# EAGLE design detectino (EAGLE 7.2.0)
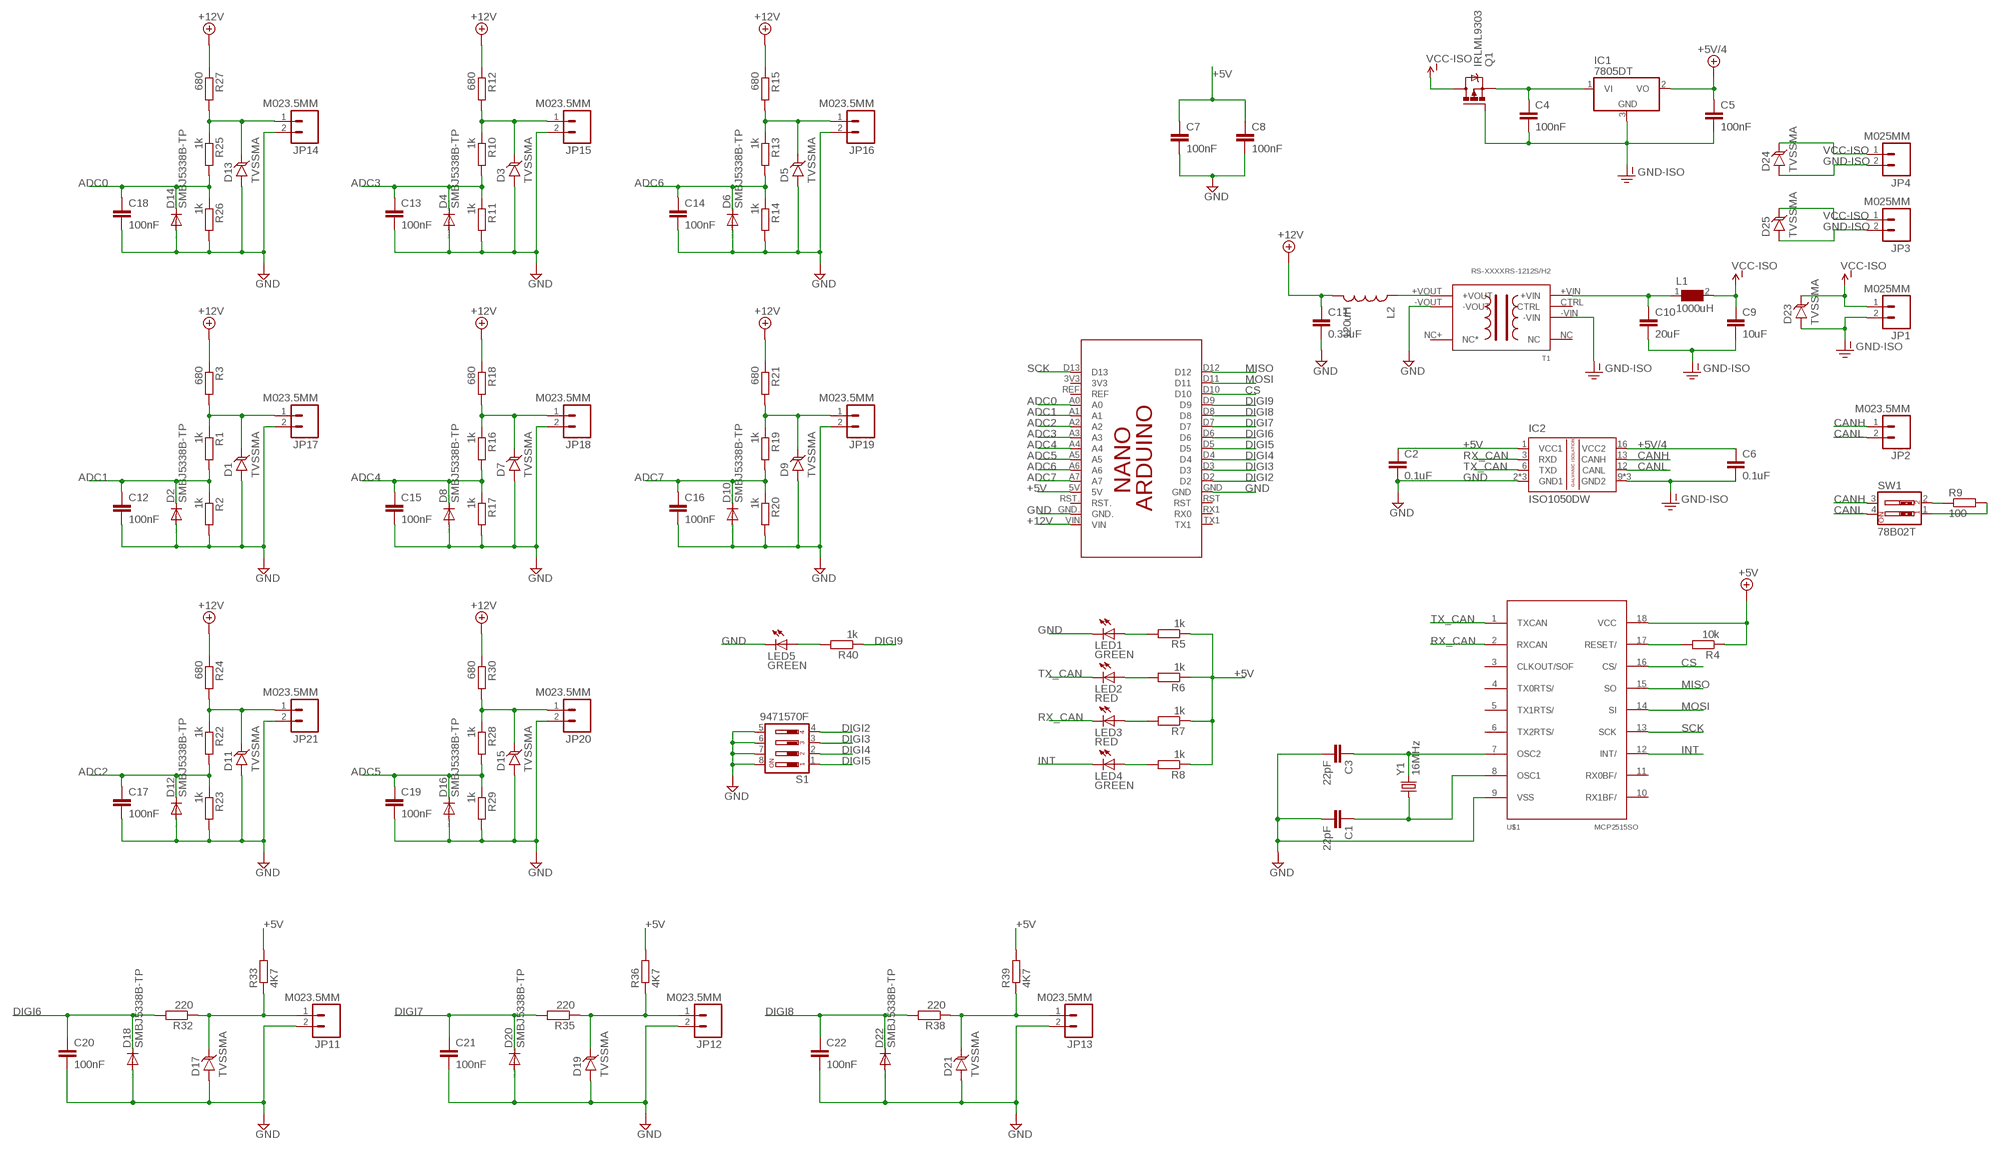
[diagram p0: schematic, sheet 1]

## Parts
C1  22pF  C-EUC0805K  [C0805K]
C2  0.1uF  C-EUC0805K  [C0805K]
C3  22pF  C-EUC0805K  [C0805K]
C4  100nF  C-EUC0805K  [C0805K]
C5  100nF  C-EUC0805K  [C0805K]
C6  0.1uF  C-EUC0805K  [C0805K]
C7  100nF  C-EUC0805K  [C0805K]
C8  100nF  C-EUC0805K  [C0805K]
C9  10uF  C-EUC0805K  [C0805K]
C10  20uF  C-EUC0805K  [C0805K]
C11  0.33uF  C-EUC0805K  [C0805K]
C12  100nF  C-EUC0805K  [C0805K]
C13  100nF  C-EUC0805K  [C0805K]
C14  100nF  C-EUC0805K  [C0805K]
C15  100nF  C-EUC0805K  [C0805K]
C16  100nF  C-EUC0805K  [C0805K]
C17  100nF  C-EUC0805K  [C0805K]
C18  100nF  C-EUC0805K  [C0805K]
C19  100nF  C-EUC0805K  [C0805K]
C20  100nF  C-EUC0805K  [C0805K]
C21  100nF  C-EUC0805K  [C0805K]
C22  100nF  C-EUC0805K  [C0805K]
D1  TVSSMA  [SMA-DIODE]
D2  SMBJ5338B-TP  DIODE-DO214AA  [DO214AA]
D3  TVSSMA  [SMA-DIODE]
D4  SMBJ5338B-TP  DIODE-DO214AA  [DO214AA]
D5  TVSSMA  [SMA-DIODE]
D6  SMBJ5338B-TP  DIODE-DO214AA  [DO214AA]
D7  TVSSMA  [SMA-DIODE]
D8  SMBJ5338B-TP  DIODE-DO214AA  [DO214AA]
D9  TVSSMA  [SMA-DIODE]
D10  SMBJ5338B-TP  DIODE-DO214AA  [DO214AA]
D11  TVSSMA  [SMA-DIODE]
D12  SMBJ5338B-TP  DIODE-DO214AA  [DO214AA]
D13  TVSSMA  [SMA-DIODE]
D14  SMBJ5338B-TP  DIODE-DO214AA  [DO214AA]
D15  TVSSMA  [SMA-DIODE]
D16  SMBJ5338B-TP  DIODE-DO214AA  [DO214AA]
D17  TVSSMA  [SMA-DIODE]
D18  SMBJ5338B-TP  DIODE-DO214AA  [DO214AA]
D19  TVSSMA  [SMA-DIODE]
D20  SMBJ5338B-TP  DIODE-DO214AA  [DO214AA]
D21  TVSSMA  [SMA-DIODE]
D22  SMBJ5338B-TP  DIODE-DO214AA  [DO214AA]
D23  TVSSMA  [SMA-DIODE]
D24  TVSSMA  [SMA-DIODE]
D25  TVSSMA  [SMA-DIODE]
IC1  7805DT  [TO252]
IC2  ISO1050DW  [SO-16DW]
JP1  M025MM  [SCREWTERMINAL-5MM-2]
JP2  M023.5MM  [SCREWTERMINAL-3.5MM-2]
JP3  M025MM  [SCREWTERMINAL-5MM-2]
JP4  M025MM  [SCREWTERMINAL-5MM-2]
JP11  M023.5MM  [SCREWTERMINAL-3.5MM-2]
JP12  M023.5MM  [SCREWTERMINAL-3.5MM-2]
JP13  M023.5MM  [SCREWTERMINAL-3.5MM-2]
JP14  M023.5MM  [SCREWTERMINAL-3.5MM-2]
JP15  M023.5MM  [SCREWTERMINAL-3.5MM-2]
JP16  M023.5MM  [SCREWTERMINAL-3.5MM-2]
JP17  M023.5MM  [SCREWTERMINAL-3.5MM-2]
JP18  M023.5MM  [SCREWTERMINAL-3.5MM-2]
JP19  M023.5MM  [SCREWTERMINAL-3.5MM-2]
JP20  M023.5MM  [SCREWTERMINAL-3.5MM-2]
JP21  M023.5MM  [SCREWTERMINAL-3.5MM-2]
L1  1000uH  WE-TIS-7447471102_1111  [WE-TIS_1111]
L2  120uH  INDUCTORSDR0403-560KL  [SDR0403]
LED1  GREEN  LEDSML0805  [SML0805]
LED2  RED  LEDSML0805  [SML0805]
LED3  RED  LEDSML0805  [SML0805]
LED4  GREEN  LEDSML0805  [SML0805]
LED5  GREEN  LEDSML0805  [SML0805]
PCB2  ARDUINO_NANO  [ARDUINO_NANO]
Q1  IRLML9303  IRLML5203  [MICRO3]
R1  1k  R-EU_0204/5  [0204/5]
R2  1k  R-EU_0204/5  [0204/5]
R3  680  R-EU_0204/5  [0204/5]
R4  10k  R-EU_R0805W  [R0805W]
R5  1k  R-EU_0204/5  [0204/5]
R6  1k  R-EU_0204/5  [0204/5]
R7  1k  R-EU_0204/5  [0204/5]
R8  1k  R-EU_0204/5  [0204/5]
R9  100  R-EU_R0805W  [R0805W]
R10  1k  R-EU_0204/5  [0204/5]
R11  1k  R-EU_0204/5  [0204/5]
R12  680  R-EU_0204/5  [0204/5]
R13  1k  R-EU_0204/5  [0204/5]
R14  1k  R-EU_0204/5  [0204/5]
R15  680  R-EU_0204/5  [0204/5]
R16  1k  R-EU_0204/5  [0204/5]
R17  1k  R-EU_0204/5  [0204/5]
R18  680  R-EU_0204/5  [0204/5]
R19  1k  R-EU_0204/5  [0204/5]
R20  1k  R-EU_0204/5  [0204/5]
R21  680  R-EU_0204/5  [0204/5]
R22  1k  R-EU_0204/5  [0204/5]
R23  1k  R-EU_0204/5  [0204/5]
R24  680  R-EU_0204/5  [0204/5]
R25  1k  R-EU_0204/5  [0204/5]
R26  1k  R-EU_0204/5  [0204/5]
R27  680  R-EU_0204/5  [0204/5]
R28  1k  R-EU_0204/5  [0204/5]
R29  1k  R-EU_0204/5  [0204/5]
R30  680  R-EU_0204/5  [0204/5]
R32  220  R-EU_0204/5  [0204/5]
R33  4K7  R-EU_0204/5  [0204/5]
R35  220  R-EU_0204/5  [0204/5]
R36  4K7  R-EU_0204/5  [0204/5]
R38  220  R-EU_0204/5  [0204/5]
R39  4K7  R-EU_0204/5  [0204/5]
R40  1k  R-EU_0204/5  [0204/5]
S1  9471570F  DS04  [DS-04]
SW1  78B02T  SW_DIP-2  [DIPSWITCH-02]
T1  RS-XXXXRS-1212S/H2  [SIP8]
U$1  MCP2515SO  [SO18L]
Y1  16MHz  CRYSTALHC49US  [HC49US]

## Nets
+5V: C2.1 C7.1 C8.1 IC2.1(VCC1) PCB2.5V R4.1 R5.1 R6.1 R7.1 R8.1 R33.2 R36.2 R39.2 U$1.18(VCC)
+5V/4: C5.1 C6.1 IC1.2(VO) IC2.16(VCC2)
+12V [vcc]: C11.1 L2.P$2 PCB2.VIN R3.1 R12.1 R15.1 R18.1 R21.1 R24.1 R27.1 R30.1
ADC0: C18.1 D14.C PCB2.A0 R25.2 R26.1
ADC1: C12.1 D2.C PCB2.A1 R1.2 R2.1
ADC2: C17.1 D12.C PCB2.A2 R22.2 R23.1
ADC3: C13.1 D4.C PCB2.A3 R10.2 R11.1
ADC4: C15.1 D8.C PCB2.A4 R16.2 R17.1
ADC5: C19.1 D16.C PCB2.A5 R28.2 R29.1
ADC6: C14.1 D6.C PCB2.A6 R13.2 R14.1
ADC7: C16.1 D10.C PCB2.A7 R19.2 R20.1
CANH: IC2.13(CANH) JP2.1 SW1.3
CANL: IC2.12(CANL) JP2.2 SW1.4
CS: PCB2.D10 U$1.16(CS/)
DIGI2: PCB2.D2 S1.4
DIGI3: PCB2.D3 S1.3
DIGI4: PCB2.D4 S1.2
DIGI5: PCB2.D5 S1.1
DIGI6: C20.1 D18.C PCB2.D6 R32.2
DIGI7: C21.1 D20.C PCB2.D7 R35.2
DIGI8: C22.1 D22.C PCB2.D8 R38.2
DIGI9: PCB2.D9 R40.1
GND: C1.2 C2.2 C3.2 C7.2 C8.2 C11.2 C12.2 C13.2 C14.2 C15.2 C16.2 C17.2 C18.2 C19.2 C20.2 C21.2 C22.2 D1.A D2.A D3.A D4.A D5.A D6.A D7.A D8.A D9.A D10.A D11.A D12.A D13.A D14.A D15.A D16.A D17.A D18.A D19.A D20.A D21.A D22.A IC2.2(GND1) IC2.7(GND1) IC2.8(GND1) JP11.2 JP12.2 JP13.2 JP14.2 JP15.2 JP16.2 JP17.2 JP18.2 JP19.2 JP20.2 JP21.2 LED1.C LED5.C PCB2.GND PCB2.GND. R2.2 R11.2 R14.2 R17.2 R20.2 R23.2 R26.2 R29.2 S1.5 S1.6 S1.7 S1.8 T1.-VOUT U$1.9(VSS)
GND-ISO: C4.2 C5.2 C6.2 C9.2 C10.2 D23.A D24.A D25.A IC1.3(GND) IC2.9(GND2) IC2.10(GND2) IC2.15(GND2) JP1.2 JP3.2 JP4.2 Q1.1(G) T1.-VIN
INT: LED4.C U$1.12(INT/)
MISO: PCB2.D12 U$1.15(SO)
MOSI: PCB2.D11 U$1.14(SI)
N$1: D1.C JP17.1 R1.1 R3.2
N$2: R4.2 U$1.17(RESET/)
N$3: C1.1 U$1.8(OSC1) Y1.1
N$4: C3.1 U$1.7(OSC2) Y1.2
N$5: C4.1 IC1.1(VI) Q1.2(S)
N$6: LED1.A R5.2
N$7: LED2.A R6.2
N$8: LED3.A R7.2
N$9: LED4.A R8.2
N$10: C10.1 L1.1 T1.+VIN
N$11: R9.1 SW1.2
N$12: R9.2 SW1.1
N$13: D3.C JP15.1 R10.1 R12.2
N$14: D5.C JP16.1 R13.1 R15.2
N$15: D7.C JP18.1 R16.1 R18.2
N$16: D9.C JP19.1 R19.1 R21.2
N$17: D11.C JP21.1 R22.1 R24.2
N$18: D13.C JP14.1 R25.1 R27.2
N$19: D15.C JP20.1 R28.1 R30.2
N$20: L2.P$1 T1.+VOUT
N$21: D17.C JP11.1 R32.1 R33.1
N$23: D19.C JP12.1 R35.1 R36.1
N$25: D21.C JP13.1 R38.1 R39.1
N$26: LED5.A R40.2
RX_CAN: IC2.3(RXD) LED3.C U$1.2(RXCAN)
SCK: PCB2.D13 U$1.13(SCK)
TX_CAN: IC2.6(TXD) LED2.C U$1.1(TXCAN)
VCC-ISO [vcc]: C9.1 D23.C D24.C D25.C JP1.1 JP3.1 JP4.1 L1.2 Q1.3(D)
Unconnected: PCB2.3V3 PCB2.REF PCB2.RST PCB2.RST. PCB2.RX1(RX0) PCB2.TX1 T1.CTRL T1.NC T1.NC+(NC*) U$1.3(CLKOUT/SOF) U$1.4(TX0RTS/) U$1.5(TX1RTS/) U$1.6(TX2RTS/) U$1.10(RX1BF/) U$1.11(RX0BF/)

## Library data of the parts
C1-C22 = rcl:C-EU: CAPACITOR, European symbol
D1 D3 D5 D7 D9 D11 D13 D15 D17 D19 D21 D23-D25 = SparkFun-DiscreteSemi:TVS: Transient voltage suppressor- prevents ESD on inputs.
D2 D4 D6 D8 D10 D12 D14 D16 D18 D20 D22 = diode:DIODE-: DIODE
IC1 = linear:78*: Positive VOLTAGE REGULATOR Source: http://cache.national.com/ds/LM/LM78L05.pdf http://www.fairchildsemi.com/ds/LM/LM7805.pdf
IC2 = texas:ISO1050: ISOLATED CAN TRANSCEIVER Source: http://focus.ti.com/lit/ds/symlink/iso1050.pdf
JP1 JP3 JP4 = SparkFun-Connectors:M02: Standard 2-pin 0.1" header. Use with - straight break away headers ( PRT-00116) - right angle break away headers (PRT-00553) - swiss pins (PRT-00743) - machine pins (PRT-00117) - female headers (PRT-00115) Molex polarized connector foot print use with: PRT-08233 with associated crimp pins and housings. 2.54_SCREWTERM for use with PRT-10571. 3.5mm Screw Terminal footprints for PRT-08084 5mm Screw Terminal footprints for use with PRT-08432; STOREFRONT_ID: PRT-08432
JP2 JP11-JP21 = SparkFun-Connectors:M02: Standard 2-pin 0.1" header. Use with - straight break away headers ( PRT-00116) - right angle break away headers (PRT-00553) - swiss pins (PRT-00743) - machine pins (PRT-00117) - female headers (PRT-00115) Molex polarized connector foot print use with: PRT-08233 with associated crimp pins and housings. 2.54_SCREWTERM for use with PRT-10571. 3.5mm Screw Terminal footprints for PRT-08084 5mm Screw Terminal footprints for use with PRT-08432
L1 = WE-TIS:WE-TIS: Shielded Radial Leaded Inductor - Shielded radial through-hole inductor - High rated and saturation current - High inductance values - Low stray field -- Filter choke -- Storage choke -- Class D amplifiers; MPN: 7447471102; OC_FARNELL: 2211759; OC_NEWARK: 44W4694; PACKAGE: 1111; SUPPLIER: Wuerth Elektronik
L2 = SparkFun-Passives:INDUCTOR: Inductors Basic Inductor/Choke - 0603 and 1206. Footprints are not proven and vary greatly between part numbers. SRN6045- 33uH, 20% 1.4A SDR0403-560KL - 56uH, 10%, 500mA RMS/740mA peak; DIST: DIGIKEY; DIST_ID: SDR0403-560KLCT-ND; VALUE: 56uH
LED1-LED5 = led:LED: LED OSRAM: - CHIPLED LG R971, LG N971, LY N971, LG Q971, LY Q971, LO R971, LY R971 LH N974, LH R974 LS Q976, LO Q976, LY Q976 LO Q996 - Hyper CHIPLED LW Q18S LB Q993, LB Q99A, LB R99A - SideLED LS A670, LO A670, LY A670, LG A670, LP A670 LB A673, LV A673, LT A673, LW A673 LH A674 LY A675 LS A676, LA A676, LO A676, LY A676, LW A676 LS A679, LY A679, LG A679 - Hyper Micro SIDELED® LS Y876, LA Y876, LO Y876, LY Y876 LT Y87S - SmartLED LW L88C, LW L88S LB L89C, LB L89S, LG L890 LS L89K, LO L89K, LY L89K LS L896, LA L896, LO L896, LY L896 - TOPLED LS T670, LO T670, LY T670, LG T670, LP T670 LSG T670, LSP T670, LSY T670, LOP T670, LYG T670 LG T671, LOG T671, LSG T671 LB T673, LV T673, LT T673, LW T673 LH T674 LS T676, LA T676, LO T676, LY T676, LB T676, LH T676, LSB T676, LW T676 LB T67C, LV T67C, LT T67C, LS T67K, LO T67K, LY T67K, LW E67C LS E67B, LA E67B, LO E67B, LY E67B, LB E67C, LV E67C, LT E67C LW T67C LS T679, LY T679, LG T679 LS T770, LO T770, LY T770, LG T770, LP T770 LB T773, LV T773, LT T773, LW T773 LH T774 LS E675, LA E675, LY E675, LS T675 LS T776, LA T776, LO T776, LY T776, LB T776 LHGB T686 LT T68C, LB T68C - Hyper Mini TOPLED® LB M676 - Mini TOPLED Santana® LG M470 LS M47K, LO M47K, LY M47K Source: http://www.osram.convergy.de LUXEON: - LUMILED® LXK2-PW12-R00, LXK2-PW12-S00, LXK2-PW14-U00, LXK2-PW14-V00 LXK2-PM12-R00, LXK2-PM12-S00, LXK2-PM14-U00 LXK2-PE12-Q00, LXK2-PE12-R00, LXK2-PE12-S00, LXK2-PE14-T00, LXK2-PE14-U00 LXK2-PB12-K00, LXK2-PB12-L00, LXK2-PB12-M00, LXK2-PB14-N00, LXK2-PB14-P00, LXK2-PB14-Q00 LXK2-PR12-L00, LXK2-PR12-M00, LXK2-PR14-Q00, LXK2-PR14-R00 LXK2-PD12-Q00, LXK2-PD12-R00, LXK2-PD12-S00 LXK2-PH12-R00, LXK2-PH12-S00 LXK2-PL12-P00, LXK2-PL12-Q00, LXK2-PL12-R00 Source: www.luxeon.com KINGBRIGHT: KA-3528ASYC Source: www.kingbright.com
PCB2 = E14_Arduino_published:ARDUINO_NANO: Device for representing an Arduino Nano board with a footprint in an EAGLE design. Created by Dave Young for Element14. More EAGLE documentation at: http://www.element14.com/community/community/knode/cadsoft_eagle
Q1 = transistor-power:IRLML5203: HEXFET P-Channel Power MOSFET
R1-R30 R32 R33 R35 R36 R38-R40 = rcl:R-EU_: RESISTOR, European symbol
S1 = switch-dil:DS04: DIL/CODE SWITCH; OC_FARNELL: 9471570; OC_NEWARK: unknown
SW1 = SparkFun-Electromechanical:SW_DIP-2: DIP SWITCH
T1 = matteo:RS-XXXX
U$1 = MCP2515_MT:MCP2515*: MCP2515 Standalone CAN-Controller by Microchip Eagle-Lib. by MartinThomas
Y1 = SparkFun-FreqCtrl:CRYSTAL: Various standard crystals. Proven footprints.

## Net classes
0 default: width 0.508 mm, clearance 0.203 mm
1 ground: width 0.762 mm, clearance 0.203 mm
2 vcc: width 0.762 mm, clearance 0.203 mm

## Board
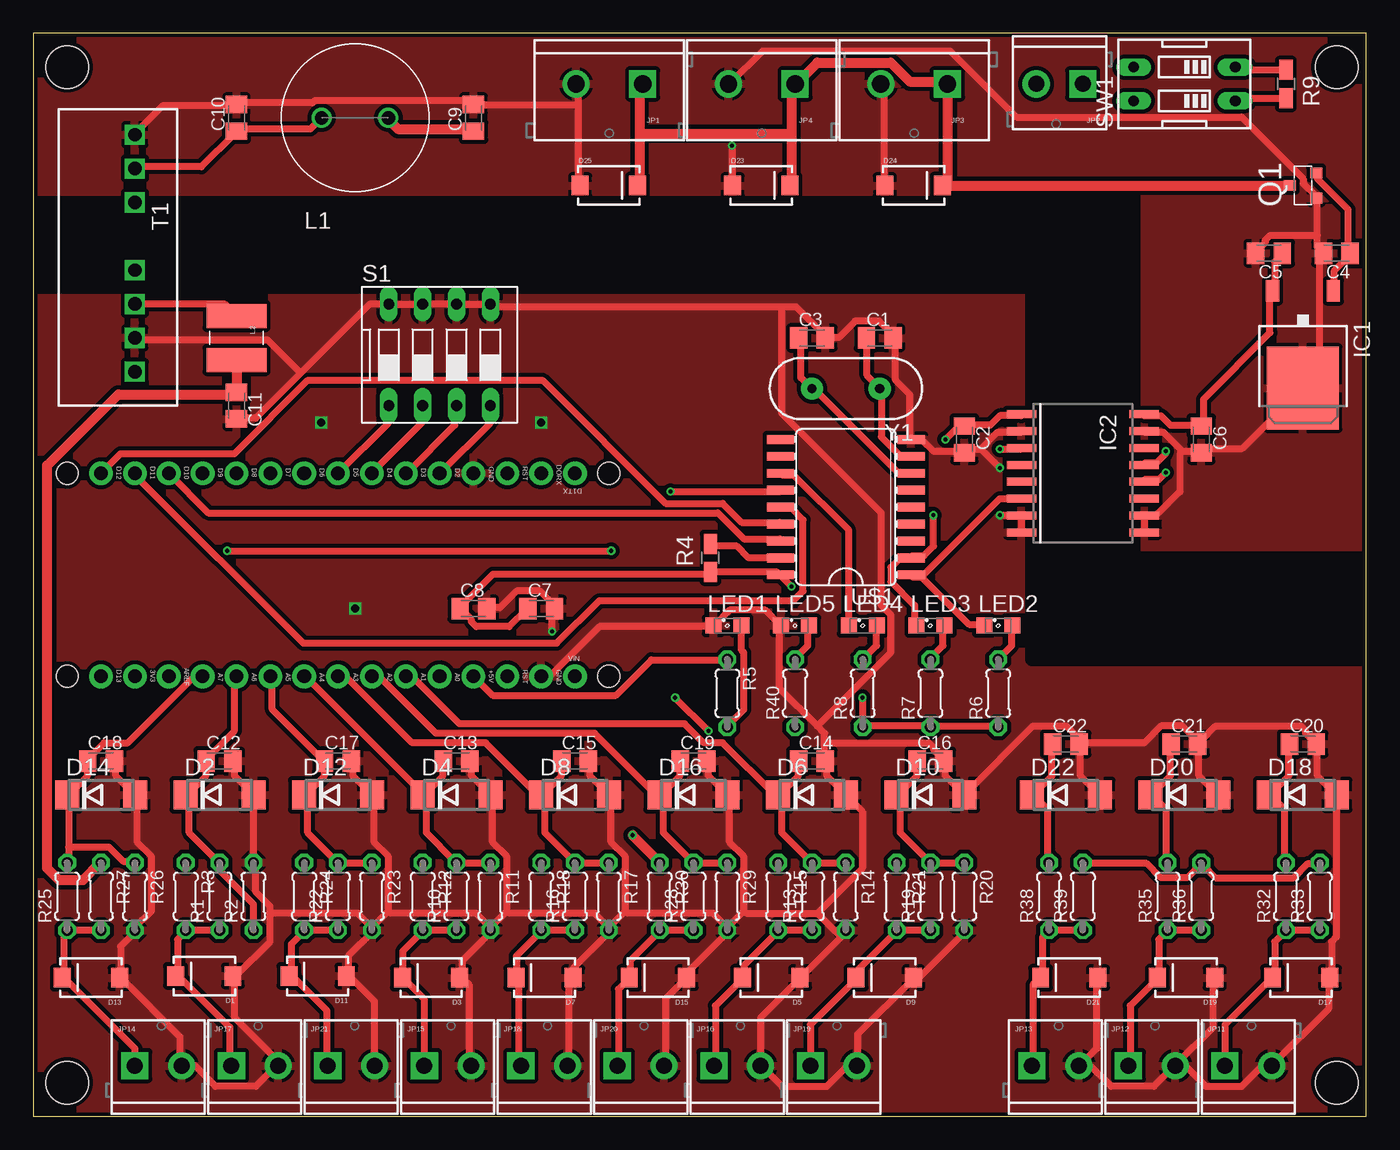
[diagram p1: board, top side]
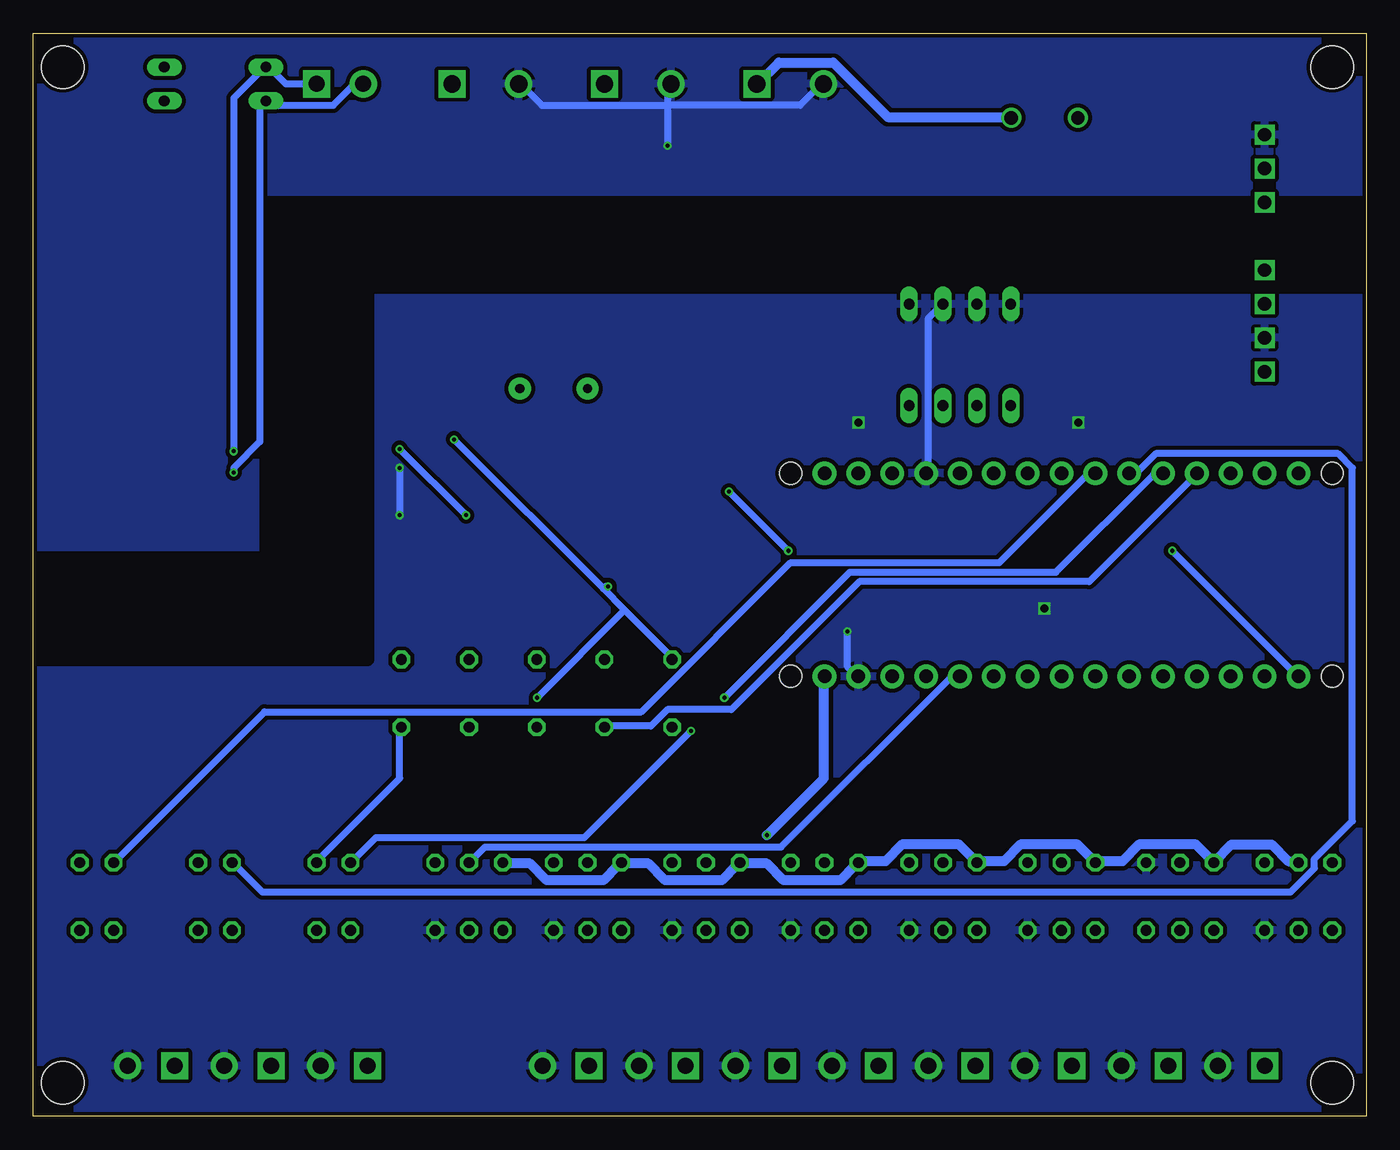
[diagram p2: board, bottom side, seen from below]

Size 100 x 81.27 mm. Coordinates in mm from the lower left corner, seen from the top.
Outline: 0,0 100,0 100,81.27 0,81.27 0,0
Copper layers (1*16): Top 0.035mm / dielectric 1.5mm / Bottom 0.035mm
Design rules "SeeedStudio_2layer_DRU_no_angle_20140221": minimum track width 6mil, minimum drill 12mil, track to track 6mil, track to pad 6mil, pad to pad 6mil, via to via 6mil, smd to smd 0mil, copper to edge 10mil, drill to drill 10mil, minimum pad ring 10mil, minimum via ring 6mil, stop-mask expansion 2mil, vias tented up to drill 100mil, thermal gap 10mil
Holes 3.2 mm at 97.79,2.54 97.79,78.74 2.54,78.74 2.54,2.54
tRestrict: area 0,34.3 to 100.3,68.6
bRestrict: area 0,34.3 to 100.3,68.6

### Footprints (pad centres in the part's own frame; a part is rotated, then mirrored left to right if it is on the bottom)
C0805K = smd 1.3 x 1.6: 1 -1,0; 2 1,0
SMA-DIODE = smd 1.27 x 1.47: A -2.15,0; C 2.15,0
DO214AA = smd 1.8 x 2.2: A 2.55,0; C -2.55,0
TO252 = smd 1 x 1.6: 1 -2.28,-4.8; 2 2.28,-4.8 | smd 5.4 x 6.2: 3 0,2.5
SO-16DW = smd 0.6 x 2.2: 1 -4.445,-4.6; 2 -3.175,-4.6; 3 -1.905,-4.6; 4 -0.635,-4.6; 5 0.635,-4.6; 6 1.905,-4.6; 7 3.175,-4.6; 8 4.445,-4.6; 9 4.445,4.6; 10 3.175,4.6; 11 1.905,4.6; 12 0.635,4.6; 13 -0.635,4.6; 14 -1.905,4.6; 15 -3.175,4.6; 16 -4.445,4.6
SCREWTERMINAL-5MM-2 = drill 1.3 pad 2.032 square: 1 0,0 | drill 1.3 pad 2.032: 2 5,0
SCREWTERMINAL-3.5MM-2 = drill 1.2 pad 2.032 square: 1 0,0 | drill 1.2 pad 2.032: 2 3.5,0
WE-TIS_1111 = drill 1: 1 -2.5,0; 2 2.5,0
SDR0403 = smd 1.8 x 4.5: P$1 -1.65,0; P$2 1.65,0
SML0805 = smd 1.2 x 1.2: A 1.05,0; C -1.05,0
ARDUINO_NANO = drill 1.016 pad 1.778: 3V3 6.35,1.27; 5V 31.75,1.27; A0 11.43,1.27; A1 13.97,1.27; A2 16.51,1.27; A3 19.05,1.27; A4 21.59,1.27; A5 24.13,1.27; A6 26.67,1.27; A7 29.21,1.27; D2 29.21,16.51; D3 26.67,16.51; D4 24.13,16.51; D5 21.59,16.51; D6 19.05,16.51; D7 16.51,16.51; D8 13.97,16.51; D9 11.43,16.51; D10 8.89,16.51; D11 6.35,16.51; D12 3.81,16.51; D13 3.81,1.27; GND 31.75,16.51; GND. 36.83,1.27; REF 8.89,1.27; RST 34.29,16.51; RST. 34.29,1.27; RX1 36.83,16.51; TX1 39.37,16.51; VIN 39.37,1.27 | hole 1.651: 1.27,1.27; 1.27,16.51; 41.91,16.51; 41.91,1.27
MICRO3 = smd 0.8 x 0.9: 1 -0.95,-1; 2 0.95,-1; 3 0,1
0204/5 = drill 0.813 octagon: 1 -2.54,0; 2 2.54,0
R0805W = smd 1.5 x 1: 1 -1.052,0; 2 1.052,0
DS-04 = drill 0.813 long: 1 -3.81,-3.81; 2 -1.27,-3.81; 3 1.27,-3.81; 4 3.81,-3.81; 5 3.81,3.81; 6 1.27,3.81; 7 -1.27,3.81; 8 -3.81,3.81
DIPSWITCH-02 = drill 0.813 long: 1 -1.27,-3.81; 2 1.27,-3.81; 3 1.27,3.81; 4 -1.27,3.81
SIP8 = drill 1 square: +VIN -7.62,0; +VOUT 2.54,0; -VIN -10.16,0; -VOUT 5.08,0; CTRL -5.08,0; NC 0,0; NC+ 7.62,0
SO18L = smd 0.66 x 2.032: 1 -5.08,-4.902; 2 -3.81,-4.902; 3 -2.54,-4.902; 4 -1.27,-4.902; 5 0,-4.902; 6 1.27,-4.902; 7 2.54,-4.902; 8 3.81,-4.902; 9 5.08,-4.902; 10 5.08,4.902; 11 3.81,4.902; 12 2.54,4.902; 13 1.27,4.902; 14 0,4.902; 15 -1.27,4.902; 16 -2.54,4.902; 17 -3.81,4.902; 18 -5.08,4.902
HC49US = drill 0.7 pad 1.651: 1 -2.54,0; 2 2.54,0

### Placement (x,y rotation side)
C1  63.5,58.42 0 top
C2  69.85,50.8 270 top
C3  58.42,58.42 0 top
C4  97.79,64.77 180 top
C5  92.71,64.77 180 top
C6  87.63,50.8 270 top
C7  38.1,38.1 0 top
C8  33.02,38.1 0 top
C9  33.02,74.93 90 top
C10  15.24,74.93 90 top
C11  15.24,53.34 270 top
C12  13.97,26.67 0 top
C13  31.75,26.67 0 top
C14  58.42,26.67 0 top
C15  40.64,26.67 0 top
C16  67.31,26.67 0 top
C17  22.86,26.67 0 top
C18  5.08,26.67 0 top
C19  49.53,26.67 0 top
C20  95.25,27.94 0 top
C21  86.36,27.94 0 top
C22  77.47,27.94 0 top
D1  12.83,10.54 180 top
D2  13.97,24.13 0 top
D3  29.84,10.41 180 top
D4  31.75,24.13 0 top
D5  55.37,10.41 180 top
D6  58.42,24.13 0 top
D7  38.35,10.41 180 top
D8  40.64,24.13 0 top
D9  63.88,10.41 180 top
D10  67.31,24.13 0 top
D11  21.34,10.54 180 top
D12  22.86,24.13 0 top
D13  4.32,10.41 180 top
D14  5.08,24.13 0 top
D15  46.86,10.41 180 top
D16  49.53,24.13 0 top
D17  95.12,10.41 180 top
D18  95.25,24.13 0 top
D19  86.49,10.41 180 top
D20  86.36,24.13 0 top
D21  77.72,10.41 180 top
D22  77.47,24.13 0 top
D23  54.61,69.85 0 top
D24  66.04,69.85 0 top
D25  43.18,69.85 0 top
IC1  95.25,57.15 180 top
IC2  78.74,48.26 270 top
JP1  45.72,77.47 180 top
JP2  78.74,77.47 180 top
JP3  68.58,77.47 180 top
JP4  57.15,77.47 180 top
JP11  89.41,3.81 0 top
JP12  82.17,3.81 0 top
JP13  74.93,3.81 0 top
JP14  7.62,3.81 0 top
JP15  29.34,3.81 0 top
JP16  51.05,3.81 0 top
JP17  14.86,3.81 0 top
JP18  36.58,3.81 0 top
JP19  58.29,3.81 0 top
JP20  43.81,3.81 0 top
JP21  22.1,3.81 0 top
L1  24.13,74.93 0 top
L2  15.24,58.42 270 top
LED1  52.07,36.83 0 top
LED2  72.39,36.83 0 top
LED3  67.31,36.83 0 top
LED4  62.23,36.83 0 top
LED5  57.15,36.83 0 top
PCB2  1.27,31.75 0 top
Q1  95.25,69.85 90 top
R1  13.97,16.51 90 top
R2  16.51,16.51 90 top
R3  11.43,16.51 270 top
R4  50.8,41.91 90 top
R5  52.07,31.75 270 top
R6  72.39,31.75 90 top
R7  67.31,31.75 90 top
R8  62.23,31.75 90 top
R9  93.98,77.47 270 top
R10  31.75,16.51 90 top
R11  34.29,16.51 270 top
R12  29.21,16.51 270 top
R13  58.42,16.51 90 top
R14  60.96,16.51 270 top
R15  55.88,16.51 270 top
R16  40.64,16.51 90 top
R17  43.18,16.51 270 top
R18  38.1,16.51 270 top
R19  67.31,16.51 90 top
R20  69.85,16.51 270 top
R21  64.77,16.51 270 top
R22  22.86,16.51 90 top
R23  25.4,16.51 270 top
R24  20.32,16.51 270 top
R25  2.54,16.51 90 top
R26  7.62,16.51 270 top
R27  5.08,16.51 270 top
R28  49.53,16.51 90 top
R29  52.07,16.51 270 top
R30  46.99,16.51 270 top
R32  93.98,16.51 90 top
R33  96.52,16.51 90 top
R35  85.09,16.51 90 top
R36  87.63,16.51 90 top
R38  76.2,16.51 90 top
R39  78.74,16.51 90 top
R40  57.15,31.75 90 top
S1  30.48,57.15 0 top
SW1  86.36,77.47 90 top
T1  7.62,63.5 270 top
U$1  60.96,45.72 90 top
Y1  60.96,54.61 180 top

### Tracks (layer width: path | path; a pad name or v marks a point on that pad's centre or on a via)
+5V  (via drill 0.3)
  Top 0.508: R6.1 72.34,29.29 67.54,29.29 R7.1 67.18,29.29 62.38,29.29 R8.1 62.2,29.46 v62.2,31.42 | R39.2 78.74,18.97 83.54,18.97 84.61,17.91 86.56,17.91 87.63,18.97 R36.2 87.81,18.8 88.7,17.91 94.56,17.91 95.63,18.97 96.52,18.97 R33.2 | C7.1 36.96,38 35.71,36.75 33.22,36.75 32.87,37.11 32.87,37.29 32.16,38 C8.1 32.33,38.18 32.33,38.53 34.47,40.66 50.65,40.66 R4.1 50.82,40.84 55.8,40.84 55.98,40.66 U$1.18 56.16,40.49 v56.87,39.78 | IC2.1 74.12,52.58 72.52,52.58 71.81,51.87 69.85,51.87 C2.1 69.67,51.69 69.32,51.69 v68.43,50.8 | R5.1 52.07,34.27 46.38,34.27 43.71,31.6 34.47,31.6 33.04,33.02 PCB2.5V
  Bottom 0.508: R6.1 72.52,29.11 72.52,25.38 78.74,19.15 R39.2 | 55.63,38 52.07,34.44 R5.1 | 55.63,38 57.23,39.6 | 57.23,39.6 v68.43,50.8 | v56.87,39.78 57.05,39.78 57.23,39.6 | 55.63,38 v62.2,31.42
+5V/4
  Top 0.508: C5.1 93.67,64.67 93.14,64.13 93.14,62 IC1.2 92.79,61.82 92.79,58.8 87.81,53.82 87.81,52.05 C6.1 87.63,51.87 85.32,51.87 84.61,52.58 83.36,52.58 IC2.16
+12V  (via drill 0.3)
  Top 0.762: L2.P$2 15.27,56.67 15.27,54.36 C11.1 14.91,54.18 6.38,54.18 1.04,48.84 1.04,18.62 1.93,17.73 3.71,17.73 4.95,18.97 R27.1 | v44.96,21.11 46.91,19.15 R30.1
  Bottom 0.762: R27.1 5.13,19.15 5.84,19.15 7.09,20.4 10.11,20.4 11.35,19.15 R3.1 12.78,20.4 17.04,20.4 18.29,19.15 20.24,19.15 R24.1 21.67,20.4 25.93,20.4 27.18,19.15 29.13,19.15 R12.1 30.56,20.4 34.82,20.4 36.07,19.15 38.02,19.15 R18.1 38.38,18.8 39.45,17.73 43.71,17.73 44.96,18.97 46.91,18.97 R30.1 47.27,18.8 48.34,17.73 52.6,17.73 53.85,18.97 55.8,18.97 R15.1 56.16,18.8 57.23,17.73 61.49,17.73 62.74,18.97 64.69,18.97 R21.1 | v44.96,21.11 40.69,25.38 40.69,33.02 PCB2.VIN
ADC0
  Top 0.508: 2.64,20.22 2.64,23.95 D14.C 2.64,24.13 4.06,25.55 4.06,26.62 C18.1 4.06,26.8 5.31,28.04 7.09,28.04 12.07,33.02 PCB2.A0 | 2.64,20.22 2.64,19.15 R25.2 | 2.64,20.22 5.66,20.22 6.73,19.15 7.62,19.15 R26.1
ADC1
  Top 0.508: R2.1 16.51,15.95 14.02,18.44 14.02,18.97 R1.2 13.84,19.15 11.71,21.29 11.71,23.95 D2.C 11.53,24.13 12.95,25.55 12.95,26.62 C12.1 12.95,26.8 15.09,28.93 15.09,33.02 PCB2.A1
ADC2
  Top 0.508: R23.1 25.4,18.97 22.91,18.97 R22.2 22.73,19.15 20.6,21.29 20.6,23.95 D12.C 20.42,24.13 21.84,25.55 21.84,26.62 C17.1 21.67,26.8 17.93,30.53 17.93,33.02 PCB2.A2
ADC3
  Top 0.508: C13.1 30.73,26.62 30.73,25.55 29.31,24.13 D4.C | R11.1 34.29,18.97 31.8,18.97 R10.2 31.62,19.15 29.49,21.29 29.49,23.95 D4.C | PCB2.A3 20.42,33.02 29.13,24.31 D4.C
ADC4
  Top 0.508: C15.1 39.62,26.62 39.62,25.55 38.2,24.13 D8.C | R17.1 43.18,18.97 40.69,18.97 R16.2 40.51,19.15 38.38,21.29 38.38,23.95 D8.C | PCB2.A4 23.44,33.02 28.42,28.04 33.93,28.04 37.85,24.13 D8.C
ADC5
  Top 0.508: C19.1 48.51,26.62 48.51,25.55 47.09,24.13 D16.C | R29.1 52.07,18.97 49.58,18.97 R28.2 49.4,19.15 47.27,21.29 47.27,23.95 D16.C | PCB2.A5 25.93,33.02 30.2,28.75 42.11,28.75 46.74,24.13 D16.C
ADC6
  Top 0.508: C14.1 57.4,26.62 57.4,25.55 55.98,24.13 D6.C | R14.1 60.96,18.97 58.47,18.97 R13.2 58.29,19.15 56.16,21.29 56.16,23.95 D6.C | PCB2.A6 28.42,33.02 31.98,29.46 48.87,29.46 50.29,28.04 51.71,28.04 55.63,24.13 D6.C
ADC7
  Top 0.508: C16.1 66.29,26.62 66.29,25.55 64.87,24.13 D10.C 65.05,23.95 65.05,21.29 67.18,19.15 R19.2 67.36,18.97 69.85,18.97 R20.1
  Bottom 0.508: PCB2.A7 31.09,33.02 43.89,20.22 66.12,20.22 67.18,19.15 R19.2
CANH  (via drill 0.3)
  Top 0.508: v84.96,49.91 84.96,49.73 84.25,49.02 83.36,49.02 IC2.13
  Bottom 0.508: v84.96,49.91 84.96,76.4 82.65,78.71 SW1.3 82.3,78.71 81.05,77.47 JP2.1
CANL  (via drill 0.3)
  Top 0.508: v84.96,48.31 84.43,47.78 83.36,47.78 IC2.12
  Bottom 0.508: v84.96,48.31 84.96,48.67 83.01,50.62 83.01,75.69 82.65,76.05 SW1.4 82.47,75.87 77.5,75.87 75.9,77.47 JP2.2
CS
  Top 0.508: PCB2.D10 13.13,45.29 51.36,45.29 53.31,43.33 55.98,43.33 U$1.16
DIGI2
  Top 0.508: S1.4 34.29,52.05 30.56,48.31 PCB2.D2
DIGI3
  Top 0.508: S1.3 31.62,53.29 31.62,51.87 28.07,48.31 PCB2.D3
DIGI4
  Top 0.508: S1.2 29.13,53.29 29.13,52.05 25.4,48.31 PCB2.D4
DIGI5
  Top 0.508: PCB2.D5 26.64,52.05 26.64,53.29 S1.1
DIGI6
  Top 0.508: C20.1 94.21,27.86 94.21,25.55 92.79,24.13 D18.C 92.96,23.95 93.85,23.06 93.85,19.15 R32.2
  Bottom 0.508: PCB2.D6 20.42,48.13 20.96,48.13 27.53,41.55 43.18,41.55 54.38,30.35 82.65,30.35 93.85,19.15 R32.2
DIGI7
  Top 0.508: C21.1 85.32,27.86 85.32,25.55 83.9,24.13 D20.C 84.07,23.95 84.96,23.06 84.96,19.15 R35.2
  Bottom 0.508: PCB2.D7 17.75,48.31 17.22,48.31 15.8,49.73 2.11,49.73 1.04,48.67 1.04,22.17 3.89,19.33 3.89,18.62 5.66,16.84 82.83,16.84 84.96,18.97 R35.2
DIGI8  (via drill 0.3)
  Top 0.508: C22.1 76.43,27.86 76.43,25.55 75.01,24.13 D22.C 75.18,23.95 76.07,23.06 76.07,19.15 R38.2 | v50.65,28.93 v48.16,31.42
  Bottom 0.508: v48.16,31.42 38.73,40.84 23.27,40.84 15.98,48.13 15.27,48.13 PCB2.D8 | v50.65,28.93 58.65,20.93 74.3,20.93 76.07,19.15 R38.2
DIGI9
  Bottom 0.508: R40.1 57.05,29.29 53.67,29.29 52.43,30.53 47.62,30.53 38.02,40.13 20.78,40.13 12.78,48.13 PCB2.D9
GND  (via drill 0.3, 0.6)
  Top 0.508: C18.2 6.2,26.62 6.2,25.55 D14.A 7.8,23.95 7.8,20.57 8.87,19.51 8.87,15.42 7.62,14.17 R26.2 7.62,13.82 6.55,12.75 6.55,10.44 D13.A 6.73,10.26 11,5.99 11,3.86 JP14.2 11.35,3.86 12.07,3.86 13.67,2.26 16.69,2.26 18.11,3.68 JP17.2 18.29,3.86 18.29,4.22 15.09,7.42 15.09,10.44 D1.A 15.27,10.62 17.75,13.11 17.75,15.24 | C12.2 15.09,26.62 15.09,25.55 D2.A 16.51,23.95 R2.2 16.69,18.97 16.69,16.84 17.75,15.77 17.75,15.24 | C17.2 23.98,26.62 23.98,25.55 D12.A 25.58,23.95 25.58,20.57 26.64,19.51 26.64,15.42 | R23.2 25.4,13.82 23.62,12.04 23.62,10.62 D11.A 23.8,10.44 25.58,8.66 25.58,3.86 JP21.2 | 26.64,15.42 25.4,14.17 R23.2 | C13.2 32.87,26.62 32.87,25.55 D4.A 34.47,23.95 34.47,20.57 35.53,19.51 35.53,15.42 | R11.2 34.29,13.82 32.16,11.68 32.16,10.44 D3.A 32.33,10.26 32.69,9.91 32.69,3.86 JP15.2 | 35.53,15.42 34.29,14.17 R11.2 | 26.64,15.42 26.82,15.24 33.22,15.24 34.11,14.35 R11.2 | 17.75,15.24 24.33,15.24 25.22,14.35 R23.2 | C15.2 41.76,26.62 41.76,25.55 D8.A 43.36,23.95 43.36,20.57 44.42,19.51 44.42,15.42 | R17.2 43.18,13.82 40.51,11.15 40.51,10.44 D7.A 40.33,10.26 40.16,10.08 40.16,3.86 JP18.2 | 44.42,15.42 43.18,14.17 R17.2 | R20.2 69.85,13.82 66.47,10.44 66.12,10.44 D9.A 65.94,10.26 61.85,6.17 61.85,3.86 JP19.2 61.67,3.68 60.96,3.68 59.54,2.26 56.16,2.26 54.74,3.68 JP16.2 54.56,3.86 54.56,7.42 57.4,10.26 D5.A 57.58,10.44 60.96,13.82 R14.2 60.43,13.64 58.83,15.24 | C19.2 50.65,26.62 50.65,25.55 D16.A 52.25,23.95 52.25,20.57 53.31,19.51 53.31,15.42 | R29.2 52.07,13.82 49.05,10.8 49.05,10.44 D15.A 48.87,10.26 47.45,8.84 47.45,3.86 JP20.2
  Top 0.508: 53.31,15.42 52.07,14.17 R29.2 | 58.83,15.24 53.49,15.24 53.31,15.42 | 44.42,15.42 44.6,15.24 51,15.24 51.89,14.35 R29.2 | 35.53,15.42 35.71,15.24 42.11,15.24 43,14.35 R17.2 | IC2.8 74.12,43.87 74.12,44.93 IC2.7 73.94,45.11 v72.52,45.11 | 71.09,50.09 72.34,51.33 74.12,51.33 IC2.2 | 71.09,50.09 70.03,50.09 C2.2 69.85,49.91 67.54,49.91 66.65,50.8 U$1.9 65.76,50.98 65.76,54.18 64.69,55.24 64.69,58.27 C1.2 64.34,58.45 64.34,58.8 63.45,59.69 61.67,59.69 60.43,58.45 59.54,58.45 C3.2 59.36,58.62 57.23,60.76 56.16,60.76 | 71.09,50.09 v72.52,48.67 | 20.07,55.78 25.22,60.94 26.64,60.94 S1.8 26.82,60.94 28.96,60.94 S1.7 29.31,60.94 31.62,60.94 S1.6 31.98,60.94 34.29,60.94 S1.5 34.47,60.76 56.16,60.76 | 20.07,55.78 16.69,52.4 15.27,52.4 C11.2 | 20.07,55.78 17.58,58.27 7.62,58.27 T1.-VOUT | D21.A 79.81,10.26 79.81,5.1 78.56,3.86 JP13.2 79.1,4.04 80.87,2.26 84.07,2.26 85.5,3.68 JP12.2 | D19.A 88.52,10.26 88.52,6.71 85.67,3.86 JP12.2 | JP12.2 86.21,4.04 87.99,2.26 90.65,2.26 92.08,3.68 92.79,3.68 JP11.2 92.96,3.86 97.23,8.13 97.23,10.26 D17.A 97.41,10.62 97.41,13.11 97.77,13.46 97.77,23.95 D18.A 97.77,24.13 96.34,25.55 96.34,27.86 C20.2 96.16,28.04 95.45,28.75 95.45,28.93 95.1,29.29 88.7,29.29 87.63,28.22 C21.2 | C22.2 78.56,27.86 78.56,25.55 79.98,24.13 D22.A | C21.2 87.45,27.86 87.45,25.55 88.88,24.13 D20.A | C22.2 78.74,28.04 83.36,28.04 84.61,29.29 86.21,29.29 87.45,28.04 C21.2 | C8.2 34.11,38.18 35,38.18 36.25,39.42 38.02,39.42 39.27,38.18 C7.2 38.91,38 v38.91,36.4 | 58.83,29.29 59.36,28.75 59.36,28.04 | 58.83,29.29 55.98,32.13 55.98,36.75 LED5.C 55.98,36.93 54.91,38 52.25,38 51.18,36.93 LED1.C 50.82,36.75 42.47,36.75 38.73,33.02 PCB2.GND.
  Top 0.508: 59.36,28.04 59.36,26.8 C14.2 59.54,26.62 59.54,25.55 D6.A 61.14,23.95 62.2,22.89 62.2,18.62 58.83,15.24 | 59.36,28.04 67.18,28.04 67.54,27.69 67.54,27.51 68.25,26.8 C16.2 68.43,26.62 68.43,25.55 D10.A 70.03,24.31 75.01,29.29 77.5,29.29 78.56,28.22 C22.2 | 56.16,60.76 56.16,52.76 63.63,45.29 63.63,38.35 64.34,37.64 64.34,34.8 58.83,29.29
  Bottom 0.508: v72.52,48.67 v72.52,45.11 | PCB2.GND 32.87,48.31 32.87,59.87 31.8,60.94 S1.6 | v38.91,36.4 38.91,33.73 38.2,33.02 PCB2.GND.
  other vias: 24.13,38.1 21.59,52.07 38.1,52.07
  pour Bottom (isolate 0.305): 0,62.23 74.93,62.23 74.93,34.29 100.33,34.29 100.33,33.02 100.33,0 0,0
  pour Top (isolate 0.305): 0,62.23 74.93,62.23 74.93,34.29 100.33,34.29 100.33,0 0,0
GND-ISO  (via drill 0.3)
  Top 0.508: IC2.9 83.36,43.87 83.36,44.93 IC2.10 83.54,45.11 84.25,45.11 86.03,46.89 86.03,49.73 86.21,49.91 | 86.21,49.91 87.63,49.91 C6.2 87.81,50.09 90.65,50.09 95.1,54.53 IC1.3 95.28,54.71 96.52,55.96 96.52,64.67 C4.2 96.7,64.85 96.34,65.2 96.34,66.09 | 86.21,49.91 84.79,51.33 83.36,51.33 IC2.15 | 96.34,66.09 96.34,68.76 Q1.1 96.16,69.11 95.28,70 95.28,70.36 90.65,74.98 73.76,74.98 68.78,79.96 54.74,79.96 52.25,77.47 JP4.2 | 96.34,66.09 92.79,66.09 92.43,65.73 92.43,65.56 91.72,64.85 C5.2 | v52.43,72.85 52.43,70 D23.A | D24.A 63.8,70 63.8,77.29 63.63,77.47 JP3.2 | T1.-VIN 7.62,73.74 9.75,75.87 15.09,75.87 C10.2 15.44,76.05 20.96,76.05 21.13,76.22 32.69,76.22 32.87,76.05 C9.2 33.04,75.87 40.87,75.87 | 40.87,75.87 40.87,77.47 JP1.2 | 40.87,75.87 40.87,70 D25.A
  Bottom 0.508: 52.43,75.87 52.43,77.29 52.25,77.47 JP4.2 | 52.43,75.87 v52.43,72.85 | 52.43,75.87 61.85,75.87 63.45,77.47 JP3.2 | 52.43,75.87 42.47,75.87 40.87,77.47 JP1.2
  pour Bottom (isolate 0.305): 0,81.28 100.33,81.28 100.33,41.91 82.55,41.91 82.55,68.58 0,68.58 0,69.85
  pour Top (isolate 0.305): 0,81.28 100.33,81.28 100.33,41.91 82.55,41.91 82.55,68.58 0,68.58
INT
  Top 0.508: LED4.C 61.14,36.93 61.14,44.04 57.05,48.13 56.16,48.13 U$1.12
MISO
  Top 0.508: PCB2.D12 6.55,49.73 15.09,49.73 20.6,55.24 38.2,55.24 47.45,46 51.71,46 53.14,44.58 55.98,44.58 U$1.15
MOSI
  Top 0.508: U$1.14 56.16,45.64 56.87,45.64 57.76,44.76 57.76,39.42 57.05,38.71 42.47,38.71 39.27,35.51 20.24,35.51 7.62,48.13 PCB2.D11
N$1
  Top 0.508: R1.1 13.84,14 11.53,14 R3.2 11.35,13.82 10.82,13.28 10.82,10.62 D1.C 11,10.44 14.73,6.71 14.73,3.86 JP17.1
N$2
  Top 0.508: U$1.17 53.67,41.91 52.78,42.8 50.82,42.8 R4.2
N$3
  Top 0.508: C1.1 62.56,58.27 62.56,55.6 63.45,54.71 Y1.1 63.63,54.53 63.63,50.98 65.05,49.55 65.76,49.55 U$1.8
N$4
  Top 0.508: C3.1 57.58,58.27 57.58,55.42 58.29,54.71 Y1.2 58.65,54.53 64.87,48.31 65.76,48.31 U$1.7
N$5
  Top 0.508: Q1.2 96.34,70.71 96.34,70.36 98.65,68.05 98.65,64.85 C4.1 98.83,64.67 97.59,63.42 97.59,62 IC1.1
N$6
  Top 0.508: LED1.A 53.14,36.75 53.14,34.98 53.31,34.8 53.31,30.53 52.07,29.29 R5.2
N$7
  Top 0.508: LED2.A 73.41,36.75 73.41,35.33 72.52,34.44 R6.2
N$8
  Top 0.508: LED3.A 68.25,36.75 68.25,35.33 67.36,34.44 R7.2
N$9
  Top 0.508: R8.2 63.27,35.33 63.27,36.75 LED4.A
N$10
  Top 0.508: L1.1 21.49,74.8 20.78,74.09 15.27,74.09 C10.1 15.09,73.74 12.6,71.25 7.62,71.25 T1.+VIN
N$11
  Top 0.508: R9.1 93.85,78.54 90.48,78.54 90.3,78.71 SW1.2
N$12
  Top 0.508: R9.2 93.85,76.4 90.48,76.4 90.3,76.22 SW1.1
N$13
  Top 0.508: R10.1 31.62,14 29.31,14 R12.2 29.13,13.82 27.71,12.39 27.71,10.44 D3.C 27.89,10.26 29.31,8.84 29.31,3.86 JP15.1
N$14
  Top 0.508: R13.1 58.29,14 55.98,14 R15.2 55.8,13.82 53.31,11.33 53.31,10.44 D5.C 53.14,10.26 51.18,8.31 51.18,3.86 JP16.1
N$15
  Top 0.508: R16.1 40.51,14 38.2,14 R18.2 38.02,13.82 36.25,12.04 36.25,10.44 D7.C 36.42,10.26 36.42,3.86 JP18.1
N$16
  Top 0.508: R19.1 67.18,14 64.87,14 R21.2 64.69,13.82 61.85,10.97 61.85,10.44 D9.C 61.67,10.26 58.29,6.88 JP19.1
N$17
  Top 0.508: R22.1 22.73,14 20.42,14 R24.2 20.24,13.82 19.36,12.93 19.36,10.62 D11.C 19.53,10.44 22.02,7.95 22.02,3.86 JP21.1
N$18
  Top 0.508: R27.2 4.95,14 2.64,14 R25.1 2.46,13.82 2.29,13.64 2.29,10.44 D13.C 2.46,10.26 7.62,5.1 JP14.1
N$19
  Top 0.508: R28.1 49.4,14 47.09,14 R30.2 46.91,13.82 44.78,11.68 44.78,10.44 D15.C 44.6,10.26 43.89,9.55 43.89,3.86 JP20.1
N$20
  Top 0.508: T1.+VOUT 7.62,60.94 14.38,60.94 15.09,60.22 L2.P$1
N$21
  Top 0.508: R33.1 96.52,14 94.21,14 R32.1 93.85,13.82 93.14,13.11 93.14,10.44 D17.C 92.79,10.26 89.41,6.88 JP11.1
N$23
  Top 0.508: R36.1 87.63,14 85.32,14 R35.1 84.96,13.82 84.43,13.28 84.43,10.44 D19.C 84.25,10.26 82.3,8.31 82.3,3.86 JP12.1
N$25
  Top 0.508: R39.1 78.74,14 76.43,14 R38.1 76.07,13.82 75.72,13.46 75.72,10.44 D21.C 75.36,10.26 75.01,9.91 75.01,3.86 JP13.1
N$26
  Top 0.508: LED5.A 58.11,36.75 58.11,35.33 57.23,34.44 R40.2
RX_CAN  (via drill 0.3)
  Top 0.508: LED3.C 66.12,36.93 66.12,38.35 64.34,40.13 64.34,41.2 65.05,41.91 U$1.2 65.94,42.09 66.83,42.09 67.54,42.8 v67.54,45.11 | v72.52,50.09 74.12,50.09 IC2.3
  Bottom 0.508: v67.54,45.11 v72.52,50.09
SCK  (via drill 0.3)
  Top 0.508: v47.8,46.89 55.98,46.89 U$1.13 | v14.55,42.44 v43.36,42.44
  Bottom 0.508: v43.36,42.44 v47.8,46.89 | v14.55,42.44 5.13,33.02 PCB2.D13
TX_CAN
  Top 0.508: LED2.C 71.27,36.93 70.21,36.93 66.65,40.49 65.94,40.49 U$1.1 66.83,40.66 72.52,46.36 IC2.6
VCC-ISO
  Top 0.762: Q1.3 94.21,69.82 68.25,69.82 D24.C 68.61,70.18 68.61,77.47 JP3.1 68.25,77.65 65.76,77.65 64.34,79.07 58.83,79.07 57.4,77.65 JP4.1 57.05,77.47 56.87,77.29 56.87,73.74 | 56.87,73.74 56.87,70 D23.C | C9.1 32.87,74.09 27.36,74.09 26.64,74.8 L1.2 | 45.49,73.74 45.49,77.29 45.67,77.47 JP1.1 | 45.49,73.74 45.49,70 D25.C | 45.49,73.74 56.87,73.74
  Bottom 0.762: L1.2 26.64,74.98 35.89,74.98 39.98,79.07 44.07,79.07 45.67,77.47 JP1.1